# Altium schematic sheet Driver.SchDoc
size A3
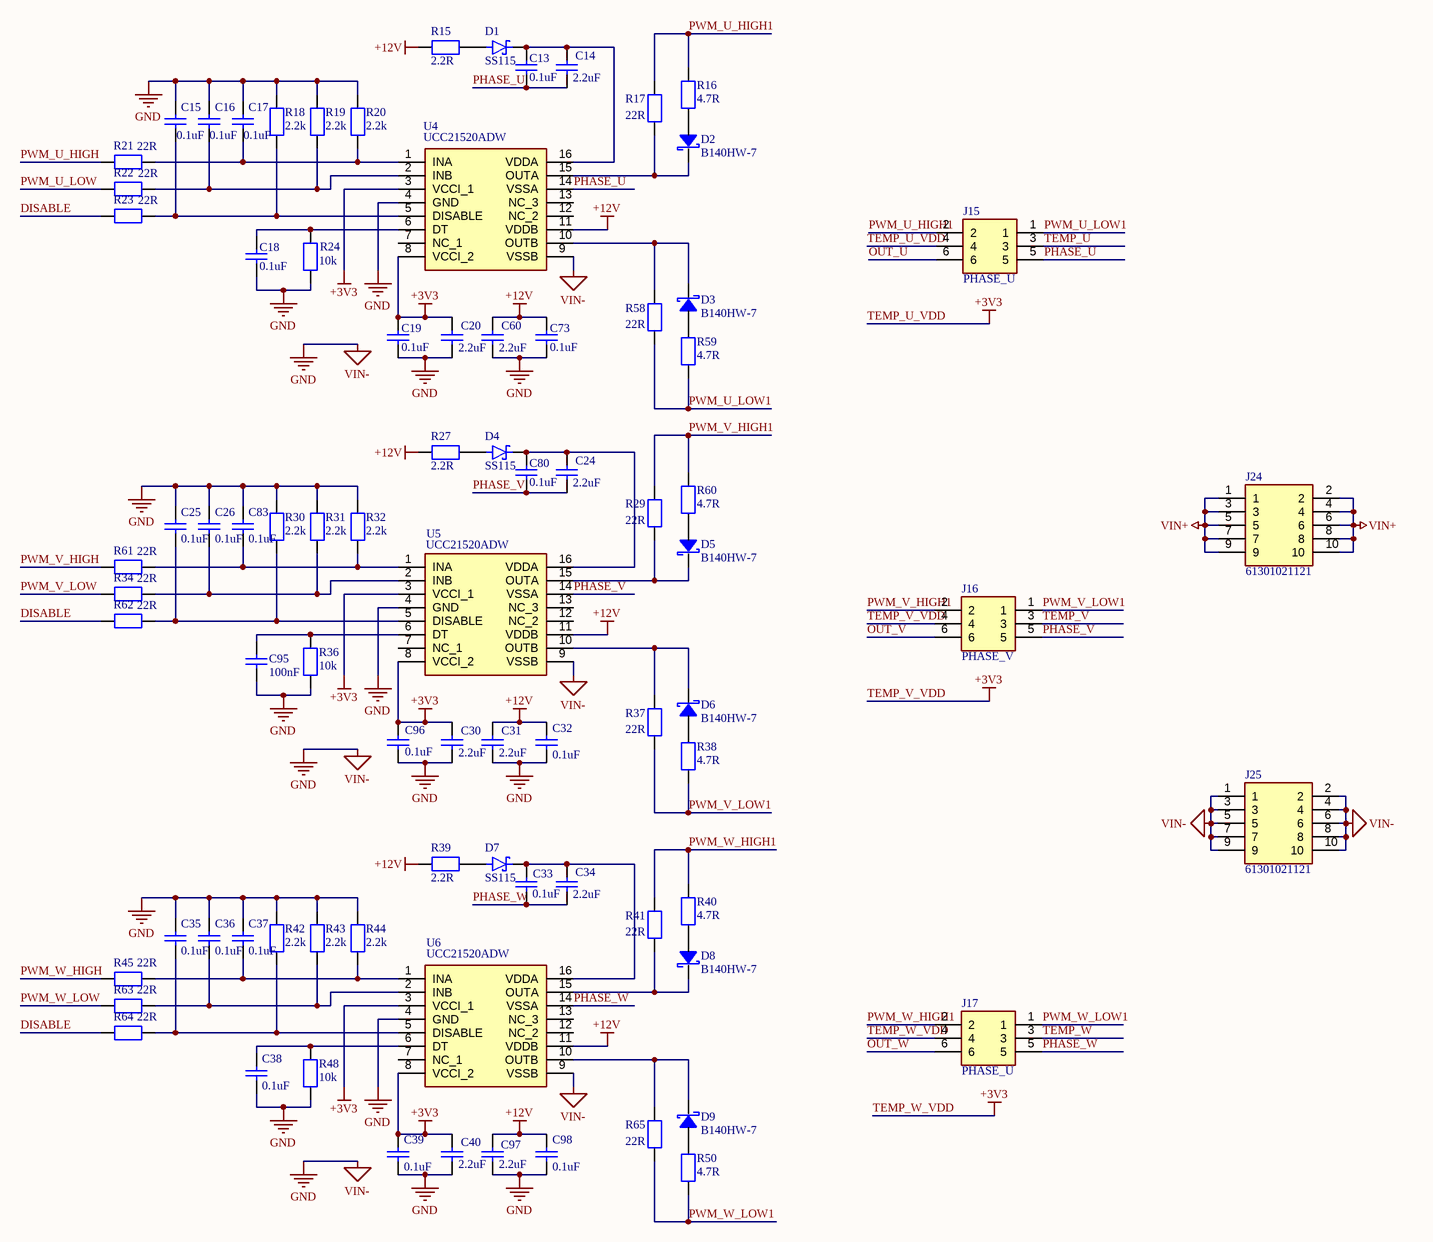
[diagram p0: Driver.SchDoc]

## Parts
C13  0.1uF  [C0603]
C14  2.2uF  [C0805]
C15  0.1uF  [C0603]
C16  0.1uF  [C0603]
C17  0.1uF  [C0603]
C18  0.1uF  [C0603]
C19  0.1uF  [C0603]
C20  2.2uF  [C0805]
C24  2.2uF  [C0805]
C25  0.1uF  [C0603]
C26  0.1uF  [C0603]
C30  2.2uF  [C0805]
C31  2.2uF  [C0805]
C32  0.1uF  [C0603]
C33  0.1uF  [C0603]
C34  2.2uF  [C0805]
C35  0.1uF  [C0603]
C36  0.1uF  [C0603]
C37  0.1uF  [C0603]
C38  0.1uF  [C0603]
C39  0.1uF  [C0603]
C40  2.2uF  [C0805]
C60  2.2uF  [C0805]
C73  0.1uF  [C0603]
C80  0.1uF  [C0603]
C83  0.1uF  [C0603]
C95  100nF  [C0603]
C96  0.1uF  [C0603]
C97  2.2uF  [C0805]
C98  0.1uF  [C0603]
D1  SS115  [DIOM4325X250N]
D2  B140HW-7  [SOD123]
D3  B140HW-7  [SOD123]
D4  SS115  [DIOM4325X250N]
D5  B140HW-7  [SOD123]
D6  B140HW-7  [SOD123]
D7  SS115  [DIOM4325X250N]
D8  B140HW-7  [SOD123]
D9  B140HW-7  [SOD123]
J15  PHASE_U  [61300621121]
J16  PHASE_V  [61300621121]
J17  PHASE_U  [61300621121]
J24  61301021121  [HDRV10W64P254X254_2X5_1270X508X869P]
J25  61301021121  [HDRV10W64P254X254_2X5_1270X508X869P]
R15  2.2R  [R0603]
R16  4.7R  [R0603]
R17  22R  [R0603]
R18  2.2k  [R0603]
R19  2.2k  [R0603]
R20  2.2k  [R0603]
R21  22R  [R0603]
R22  22R  [R0603]
R23  22R  [R0603]
R24  10k  [R0603]
R27  2.2R  [R0603]
R29  22R  [R0603]
R30  2.2k  [R0603]
R31  2.2k  [R0603]
R32  2.2k  [R0603]
R34  22R  [R0603]
R36  10k  [R0603]
R37  22R  [R0603]
R38  4.7R  [R0603]
R39  2.2R  [R0603]
R40  4.7R  [R0603]
R41  22R  [R0603]
R42  2.2k  [R0603]
R43  2.2k  [R0603]
R44  2.2k  [R0603]
R45  22R  [R0603]
R48  10k  [R0603]
R50  4.7R  [R0603]
R58  22R  [R0603]
R59  4.7R  [R0603]
R60  4.7R  [R0603]
R61  22R  [R0603]
R62  22R  [R0603]
R63  22R  [R0603]
R64  22R  [R0603]
R65  22R  [R0603]
U4  UCC21520ADW  [SOIC127P1030X265-16N]
U5  UCC21520ADW  [SOIC127P1030X265-16N]
U6  UCC21520ADW  [SOIC127P1030X265-16N]

## Nets
+12V: C31.2 C32.2 C60.2 C73.2 C97.2 C98.2 R15.1 R27.1 R39.1 U4.11(VDDB) U5.11(VDDB) U6.11(VDDB)
GND: C15.2 C16.2 C17.2 C18.1 C19.1 C20.1 C25.2 C26.2 C30.1 C31.1 C32.1 C35.2 C36.2 C37.2 C38.1 C39.1 C40.1 C60.1 C73.1 C83.2 C95.1 C96.1 C97.1 C98.1 J25.1 J25.2 J25.3 J25.4 J25.5 J25.6 J25.7 J25.8 J25.9 J25.10 R18.2 R19.2 R20.2 R24.1 R30.2 R31.2 R32.2 R36.1 R42.2 R43.2 R44.2 R48.1 U4.4(GND) U4.9(VSSB) U5.4(GND) U5.9(VSSB) U6.4(GND) U6.9(VSSB)  [also labelled VIN-]
TEMP_U_VDD: C19.2 C20.2 C30.2 C39.2 C40.2 C96.2 J15.4 J16.4 J17.4 U4.3(VCCI_1) U4.8(VCCI_2) U5.3(VCCI_1) U5.8(VCCI_2) U6.3(VCCI_1) U6.8(VCCI_2)  [also labelled +3V3, TEMP_V_VDD, TEMP_W_VDD]
VIN+: J24.1 J24.2 J24.3 J24.4 J24.5 J24.6 J24.7 J24.8 J24.9 J24.10
DISABLE: R23.1 R62.1 R64.1
OUT_U: J15.6
OUT_V: J16.6
OUT_W: J17.6
PHASE_U: C13.1 C14.1 J15.5 U4.14(VSSA)
PHASE_V: C24.1 C80.1 J16.5 U5.14(VSSA)
PHASE_W: C33.1 C34.1 J17.5 U6.14(VSSA)
PWM_U_HIGH: R21.1
PWM_U_HIGH1: J15.2 R16.2 R17.2
PWM_U_LOW: R22.1
PWM_U_LOW1: J15.1 R58.1 R59.1
PWM_V_HIGH: R61.1
PWM_V_HIGH1: J16.2 R29.2 R60.2
PWM_V_LOW: R34.1
PWM_V_LOW1: J16.1 R37.1 R38.1
PWM_W_HIGH: R45.1
PWM_W_HIGH1: J17.2 R40.2 R41.2
PWM_W_LOW: R63.1
PWM_W_LOW1: J17.1 R50.1 R65.1
TEMP_U: J15.3
TEMP_V: J16.3
TEMP_W: J17.3
NetC13_2: C13.2 C14.2 D1.C(K) U4.16(VDDA)
NetC15_1: C15.1 R18.1 R23.2 U4.5(DISABLE)
NetC16_1: C16.1 R19.1 R22.2 U4.2(INB)
NetC17_1: C17.1 R20.1 R21.2 U4.1(INA)
NetC18_2: C18.2 R24.2 U4.6(DT)
NetC24_2: C24.2 C80.2 D4.C(K) U5.16(VDDA)
NetC25_1: C25.1 R30.1 R62.2 U5.5(DISABLE)
NetC26_1: C26.1 R31.1 R34.2 U5.2(INB)
NetC33_2: C33.2 C34.2 D7.C(K) U6.16(VDDA)
NetC35_1: C35.1 R42.1 R64.2 U6.5(DISABLE)
NetC36_1: C36.1 R43.1 R63.2 U6.2(INB)
NetC37_1: C37.1 R44.1 R45.2 U6.1(INA)
NetC38_2: C38.2 R48.2 U6.6(DT)
NetC83_1: C83.1 R32.1 R61.2 U5.1(INA)
NetC95_2: C95.2 R36.2 U5.6(DT)
NetD1_A: D1.A R15.2
NetD2_A: D2.A R16.1
NetD2_C: D2.C R17.1 U4.15(OUTA)
NetD3_A: D3.A R59.2
NetD3_C: D3.C R58.2 U4.10(OUTB)
NetD4_A: D4.A R27.2
NetD5_A: D5.A R60.1
NetD5_C: D5.C R29.1 U5.15(OUTA)
NetD6_A: D6.A R38.2
NetD6_C: D6.C R37.2 U5.10(OUTB)
NetD7_A: D7.A R39.2
NetD8_A: D8.A R40.1
NetD8_C: D8.C R41.1 U6.15(OUTA)
NetD9_A: D9.A R50.2
NetD9_C: D9.C R65.2 U6.10(OUTB)

Not connected (* = marked no-connect by the designer): U4 7(NC_1) 12(NC_2) 13(NC_3); U5 7(NC_1) 12(NC_2) 13(NC_3); U6 7(NC_1) 12(NC_2) 13(NC_3)

## Notes on the sheet
- THIS DOCUMENT AND THE DATA DISCLOSED HEREIN OR
- HEREWITH IS THE PROPERTY OF ALTIUM LIMITED AND MAY
- DWG NO:
- REVISION
- REV:
- DESCRIPTION
- DATE
- APPROVED
- BE FREELY DISTRIBUTED IN WHOLE. NO RIGHTS ARE
- RESERVED OR EXPRESS OR IMPLIED WARANTEE GIVEN.
- ENG:
- APPROVALS
- PROJECT
- DSN:
- CHK:
- REFERENCE DOCUMENTS
- PROJECT REVISION:
- TITLE
- DOCUMENT REVISION:
- DESIGN ITEM:
- BOM:
- FAB DWG:
- PCB DWG:
- ASSY DWG:
- SCALE:
- A3
- SIZE
- CAGE CODE
- FILE NAME
- DWG NO.
- SHEET
- OF
- REV

## Library data of the parts
C13 C15-C19 C25 C26 C32 C33 C35-C39 C73 C80 C83 C96 C98 = Cap 100nF ± 10% 50V: Multilayer Ceramic Capacitors MLCC - SMD/SMT 50 V 0.1uF X7R 0603 10%; Manufacturer: Yageo; Manufacturer Part Number: CC0603KRX7R9BB104; Value: 0.1uF; Supplier: mouser; Supplier Part Number: 603-CC603KRX7R9BB104; Price: 0.1
C14 C20 C24 C30 C31 C34 C40 C60 C97 = Cap 2.2uF ± 10% 50V: Multilayer Ceramic Capacitors MLCC - SMD/SMT 50 V 2.2uF X7R 0805 10%; Manufacturer: Yageo; Manufacturer Part Number: CC0805KKX7R9BB225; Value: 2.2uF/50V; Supplier: mouser; Supplier Part Number: 603-CC805KKX7R9BB225; Price: 0.36
C95 = 100nF ± 10% 50V: Manufacturer: Yageo; Manufacturer Part Number: CS0603KRX7R9BB104; Value: 100nF; Supplier: mouser; Supplier Part Number: 603-CS0603KRX79BB104; Price: 0.1
D1 D4 D7 = S Diodes & Rectifiers 1A 150V: Schottky Diodes & Rectifiers 1A, 150V, Schottky Rectifier; Manufacturer: Taiwan Semiconductor; Value: SS115; Price: 0.34; Supplier: Mouser; Manufacturer Part Number: SS115; Supplier Part Number: 821-SS115
D2 D3 D5 D6 D8 D9 = S Diodes & Rectifiers 1A 40V: Schottky Diodes & Rectifiers SCHOTTKY RECTIFIER SOD-123 1.0A 40V; Value: B140HW-7; Manufacturer Part Number: B140HW-7; Manufacturer: Diodes; Supplier: Mouser; Supplier Part Number: 621-B140HW-7; Price: 0.44
J15-J17 = Header 6 Pin_2: WR-PHD 2.54mm  Dual Pin Header THT 06p Wurth Elektronik WR-PHD Series, Series Number 6130, 2.54mm Pitch 6 Way 2 Row Straight PCB Header, Solder Termination; Value: 61300621121; Supplier Part Number: 710-61300621121; Supplier: Mouser; Manufacturer: Wurth Elektronik; Manufacturer Part Number: 61300621121; Price: 0.57
J24 J25 = 61301021121: Wurth Elektronik WR-PHD, 10 Way, 2 Row, Straight Pin Header; Priice: 1; Supplier Part Number: 710-61301021121; Manufacturer: Wurth Elektronik; Manufacturer Part Number: 61301021121; Value: 61301021121; Supplier: Mouser
R15 R27 R39 = Res 2.2ohm ±1% 0.1W: Thick Film Resistors - SMD 2.2 Ohms 100mW 0603 1%; Manufacturer Part Number: RC0603FR-072R2L; Manufacturer: Yageo; Value: 2.2R; Supplier: Mouser; Supplier Part Number: 603-RC0603FR-072R2L; Price: 0.1
R16 R38 R40 R50 R59 R60 = Res 4.7ohm ±1% 0.1W: Thick Film Resistors - SMD 4.7 Ohms 100mW 0603 1%; Manufacturer Part Number: RC0603FR-074R7L; Manufacturer: Yageo; Value: 4.7R; Supplier: Mouser; Supplier Part Number: 603-RC0603FR-074R7L; Price: 0.12
R17 R21-R23 R29 R34 R37 R41 R45 R58 R61-R65 = Res 22ohm ±1% 0.1W: Thick Film Resistors - SMD 22 Ohms 100mW 0603 1%; Manufacturer Part Number: RC0603FR-0722RL; Manufacturer: Yageo; Value: 22R; Supplier: Mouser; Supplier Part Number: 603-RC0603FR-0722RL; Price: 0.1
R18-R20 R30-R32 R42-R44 = 2.2 kOhms ±1% 0.1W: Manufacturer: Yageo; Manufacturer Part Number: RC0603FR-072K2L; Value: 2.2k; Supplier: Mouser; Supplier Part Number: 603-RC0603FR-072K2L; Price: 0.1
R24 R36 R48 = 10 kOhms ±1% 0.1W: Manufacturer: Yageo; Manufacturer Part Number: RC0603FR-0710KL; Value: 10k; Supplier: mouser; Supplier Part Number: 603-RC0603FR-0710KL; Price: 0.1
U4-U6 = UCC21520ADW: 4A/6A, 5.7 kVrms Isolated Dual Channel Gate Driver; Manufacturer: Texas Instruments; Supplier Part Number: 595-UCC21520ADW; Value: UCC21520ADW; Manufacturer Part Number: UCC21520ADW; Price: 7.6; Supplier: Mouser